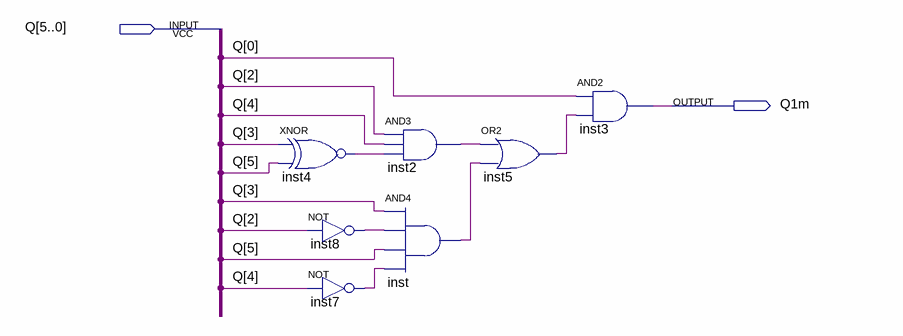
[diagram p0: schematic sheet]
// Quartus schematic GeneradorQ1.bdf as structural Verilog: 7 symbols, 2 pins
module GeneradorQ1 (
  input  [5:0] Q,
  output Q1m
);

  wire inst2_out, inst4_out, inst5_out, inst7_out, inst8_out, inst_out;

  xnor inst4 (inst4_out, Q[3], Q[5]);
  not inst8 (inst8_out, Q[2]);
  not inst7 (inst7_out, Q[4]);
  and inst2 (inst2_out, Q[2], Q[4], inst4_out);
  and inst (inst_out, Q[3], inst8_out, Q[5], inst7_out);
  or inst5 (inst5_out, inst2_out, inst_out);
  and inst3 (Q1m, Q[0], inst5_out);
endmodule
